# EAGLE schematic board (EAGLE 7.2.0)
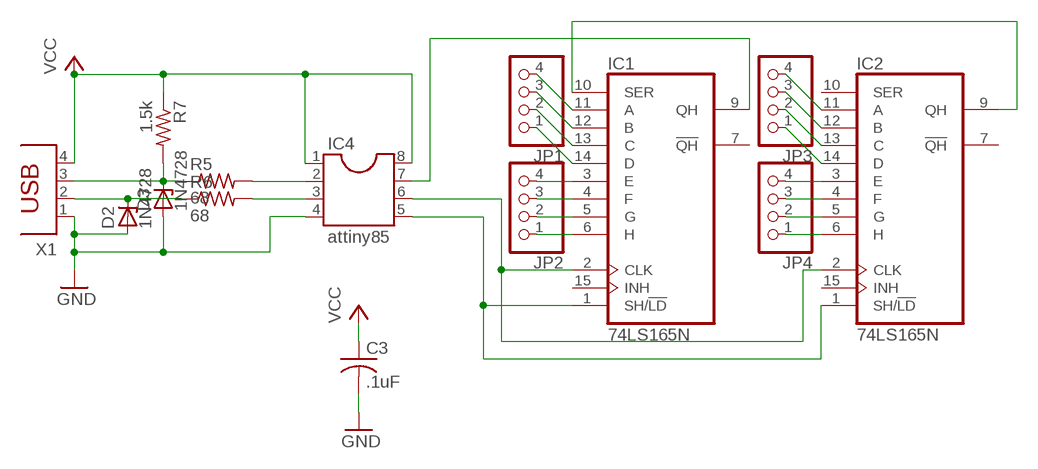
[diagram p0: schematic, sheet 1]

## Parts
C3  .1uF  C-US025-024X044  [C025-024X044]
D2  1N4728  [DO41Z10]
D3  1N4728  [DO41Z10]
IC1  74LS165N  [DIL16]
IC2  74LS165N  [DIL16]
IC4  attiny85  DIL8S  [SOCKET-08]
JP1  PINHD-1X4  [1X04]
JP2  PINHD-1X4  [1X04]
JP3  PINHD-1X4  [1X04]
JP4  PINHD-1X4  [1X04]
R5  68  R-US_0204/7  [0204/7]
R6  68  R-US_0204/7  [0204/7]
R7  1.5k  R-US_0204/7  [0204/7]
X1  PN87520  [PN87520]

## Nets
GND: C3.2 D2.A D3.A IC4.4 X1.1
N$1: D2.C R6.1 X1.2
N$2: D3.C R5.1 R7.2 X1.3
N$3: IC4.2 R5.2
N$4: IC4.3 R6.2
N$5: IC1.2(CLK) IC2.2(CLK) IC4.6
N$6: IC1.9(QH) IC4.7
N$7: IC1.1(SH/!LD) IC2.1(SH/!LD) IC4.5
N$8: IC1.10(SER) IC2.9(QH)
N$9: IC1.11(A) JP1.4
N$10: IC1.12(B) JP1.3
N$11: IC1.13(C) JP1.2
N$12: IC1.14(D) JP1.1
N$13: IC1.3(E) JP2.4
N$14: IC1.4(F) JP2.3
N$15: IC1.5(G) JP2.2
N$16: IC1.6(H) JP2.1
N$17: IC2.11(A) JP3.4
N$18: IC2.12(B) JP3.3
N$19: IC2.13(C) JP3.2
N$20: IC2.14(D) JP3.1
N$21: IC2.3(E) JP4.4
N$22: IC2.4(F) JP4.3
N$23: IC2.5(G) JP4.2
N$24: IC2.6(H) JP4.1
VCC: C3.1 IC4.1 IC4.8 R7.1 X1.4
Unconnected: IC1.7(!QH) IC1.15(INH) IC2.7(!QH) IC2.10(SER) IC2.15(INH)

## Power pins joined to a net without a drawn wire
GND: IC1.8(GND) IC2.8(GND)
VCC: IC1.16(VCC) IC2.16(VCC)

## Library data of the parts
C3 = resistor:C-US: CAPACITOR, American symbol
D2 D3 = diode:1N4728: Z DIODE 3.3 V, 1W, 5 percent
IC1 IC2 = 74xx-us:74*165: 8-bit parallel load SHIFT REGISTER
IC4 = ic-package:DIL8: Dual In Line / Socket
JP1-JP4 = pinhead:PINHD-1X4: PIN HEADER
R5-R7 = resistor:R-US_: RESISTOR, American symbol
X1 = con-berg:PN87520: BERG USB connector; OC_FARNELL: unknown; OC_NEWARK: unknown